# Altium project LAB2.PrjPcb
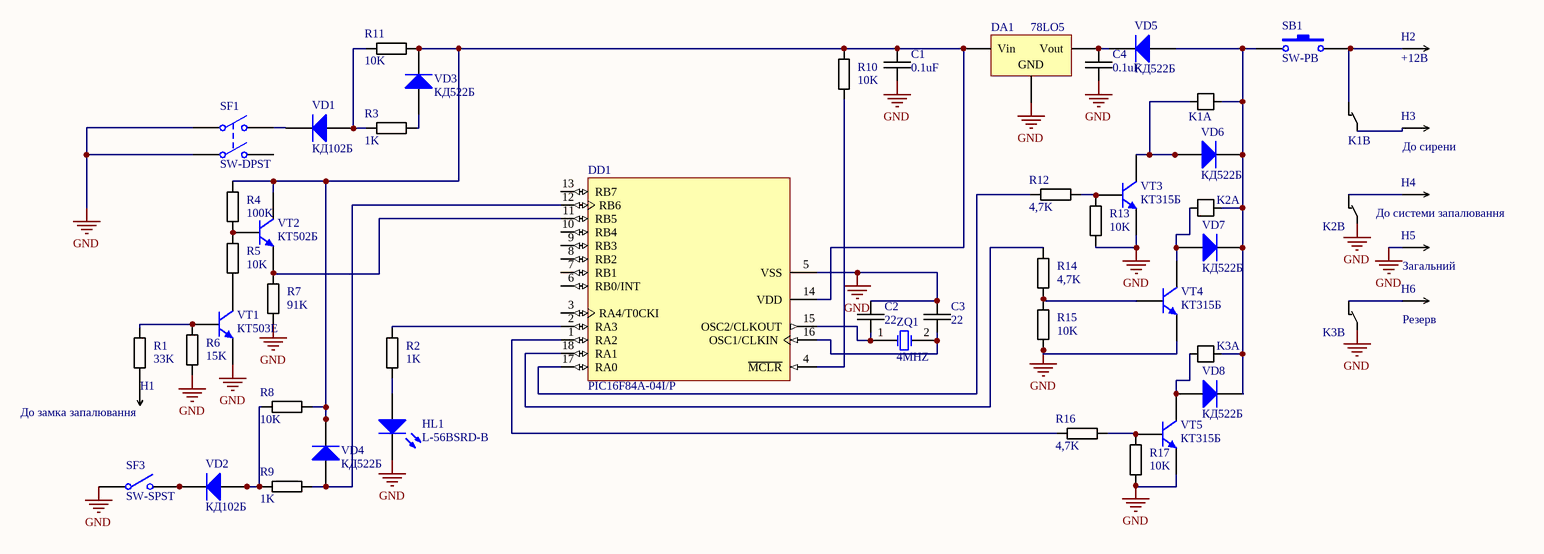
[diagram p0: LAB2.SchDoc]
1 sheet, 50 parts. Net scope: global (net labels, ports and power ports of the same name join across sheets).
Board file: LAB2.PcbDoc

## Sheet LAB2.SchDoc
size A4; SheetNumber: 1; SheetTotal: 1

### Parts
C1  0.1uF  [CAPACITOR 1206]
C2  22  [CAPACITOR 1206]
C3  22  [CAPACITOR 1206]
C4  0.1uF  [CAPACITOR 1206]
DA1  78LO5  [D2PAK_N]
DD1  PIC16F84A-04I/P  [PDIP300-P18]
H1  До замка запалювання  [Hole 2.5]
H2  +12В  [Hole 2.5]
H3  До сирени  [Hole 2.5]
H4  До системи запалювання  [Hole 2.5]
H5  Загальний  [Hole 2.5]
H6  Резерв  [Hole 2.5]
HL1  L-56BSRD-B  [LED-1]
K1  Relay SPST  [g2rl-1a-e]  (value not drawn)  (parts A,B of 2)
K2  Relay SPST  [g2rl-1a-e]  (value not drawn)  (parts A,B of 2)
K3  Relay SPST  [g2rl-1a-e]  (value not drawn)  (parts A,B of 2)
R1  33K  [Resistor 1206]
R2  1K  [Resistor 1206]
R3  1K  [Resistor 1206]
R4  100K  [Resistor 1206]
R5  10K  [Resistor 1206]
R6  15K  [Resistor 1206]
R7  91K  [Resistor 1206]
R8  10K  [Resistor 1206]
R9  1K  [Resistor 1206]
R10  10K  [Resistor 1206]
R11  10K  [Resistor 1206]
R12  4,7K  [Resistor 1206]
R13  10K  [Resistor 1206]
R14  4,7K  [Resistor 1206]
R15  10K  [Resistor 1206]
R16  4,7K  [Resistor 1206]
R17  10K  [Resistor 1206]
SB1  SW-PB  [SPST-2]
SF1  SW-DPST  [DPST-4]
SF3  SW-SPST  [SPST-2]
VD1  КД102Б  [DO-35]
VD2  КД102Б  [DO-35]
VD3  КД522Б  [DO-35]
VD4  КД522Б  [DO-35]
VD5  КД522Б  [DO-35]
VD6  КД522Б  [DO-35]
VD7  КД522Б  [DO-35]
VD8  КД522Б  [DO-35]
VT1  КТ503Е  [TO-92A]
VT2  КТ502Б  [TO-92A]
VT3  КТ315Б  [TO-92A]
VT4  КТ315Б  [TO-92A]
VT5  КТ315Б  [TO-92A]
ZQ1  4MHZ  [R38]

### Nets
GND: C1.2 C2.1 C3.1 C4.2 DA1.2(GND) DD1.5(VSS) H5.0 HL1.2(K) K2.2 K3.2 R6.2 R7.2 R13.2 R15.2 R17.2 SF1.1(COMMON1) SF1.3(COMMON2) SF3.1(COMMON) VT1.1(E) VT3.1(E) VT4.1(E) VT5.1(E)
NetC1_1: C1.1 DA1.1(Vin) DD1.14(VDD) R4.1 R8.1 R10.1 R11.2 VD3.2(K) VD4.2(K) VT2.3(C)
NetC2_2: C2.2 DD1.15(OSC2/CLKOUT) ZQ1.1(OSC1)
NetC3_2: C3.2 DD1.16(OSC1/CLKIN) ZQ1.2(OSC2)
NetC4_1: C4.1 DA1.3(Vout) VD5.2(K)
NetDD1_1: DD1.1(RA2) R16.1
NetDD1_2: DD1.2(RA3) R2.1
NetDD1_4: DD1.4(~{MCLR}) R10.2
NetDD1_11: DD1.11(RB5) R7.1 VT2.1(E)
NetDD1_12: DD1.12(RB6) R9.1 VD4.1(A)
NetDD1_17: DD1.17(RA0) R12.1
NetDD1_18: DD1.18(RA1) R14.1
NetH1_0: H1.0 R1.2
NetH2_0: H2.0 K1.3 SB1.2
NetH3_0: H3.0 K1.2
NetH4_0: H4.0 K2.3
NetH6_0: H6.0 K3.3
NetHL1_1: HL1.1(A) R2.2
NetK1_0: K1.0 VD6.1(A) VT3.3(C)
NetK1_1: K1.1 K2.1 K3.1 SB1.1 VD5.1(A) VD6.2(K) VD7.2(K) VD8.2(K)
NetK2_0: K2.0 VD7.1(A) VT4.3(C)
NetK3_0: K3.0 VD8.1(A) VT5.3(C)
NetR1_1: R1.1 R6.1 VT1.2(B)
NetR3_1: R3.1 R11.1 VD1.1(A)
NetR3_2: R3.2 VD3.1(A)
NetR4_2: R4.2 R5.1 VT2.2(B)
NetR5_2: R5.2 VT1.3(C)
NetR8_2: R8.2 R9.2 VD2.1(A)
NetR12_2: R12.2 R13.1 VT3.2(B)
NetR14_2: R14.2 R15.1 VT4.2(B)
NetR16_2: R16.2 R17.1 VT5.2(B)
NetSF1_2: SF1.2(NO1) VD1.2(K)
NetSF3_2: SF3.2(NO) VD2.2(K)

Not connected (* = marked no-connect by the designer): DD1 3(RA4/T0CKI) 6(RB0/INT) 7(RB1) 8(RB2) 9(RB3) 10(RB4) 13(RB7); SF1 4(NO2)

### Library data of the parts
C1-C4 = Capasitor: Value: *
DA1 = Volt Reg: Voltage Regulator; Published: 24-Mar-1999; LatestRevisionDate: 29-May-2009; LatestRevisionNote: IPC-7351 Footprint Added.; PackageReference: D2PAK; Publisher: Altium Limited; PackageDescription: 3-Pin Transistor Outline Package 2.54 mm Pitch, 15.1 mm Lead Span
DD1 = CMP-0115-00205-1: Enhanced FLASH/EEPROM 8-Bit Microcontroller, 1K (x14-Bit words) FLASH, 68 Bytes RAM, 4 MHz, 18-Pin PDIP, Standard VDD Range, Industrial Temperature; PackageReference: PDIP300-P18; Code_JEDEC: MS-001; DatasheetVersion: revB, Aug-2001; PackageDescription: 18-Lead Plastic Dual In-Line (P) - 300 mil Body [PDIP]; PackageVersion: revBB, Aug-2009
H1-H6 = Hole
HL1 = LED1: Typical RED GaAs LED; Published: 8-Jun-2000; LatestRevisionDate: 08-Jul-2005; LatestRevisionNote: Mech Layer 1 removed.; PackageReference: LED-1; Publisher: Altium Limited; PackageDescription: LED; 2 Leads
R1-R17 = Resistor: Value: *
SB1 = SW-PB: Switch; Published: 24-Mar-1999; LatestRevisionDate: 17-Jul-2002; LatestRevisionNote: Re-released for DXP Platform.; PackageReference: SPST-2; Publisher: Altium Limited; PackageDescription: Switch; 2 Leads
SF1 = SW-DPST: Double-Pole, Single-Throw Switch; Published: 24-Mar-1999; LatestRevisionDate: 17-Jul-2002; LatestRevisionNote: Re-released for DXP Platform.; PackageReference: DPST-4; Publisher: Altium Limited; PackageDescription: Switch; 4 Leads
SF3 = SW-SPST: Single-Pole, Single-Throw Switch; Published: 24-Mar-1999; LatestRevisionDate: 17-Jul-2002; LatestRevisionNote: Re-released for DXP Platform.; PackageReference: SPST-2; Publisher: Altium Limited; PackageDescription: Switch; 2 Leads
VD1-VD8 = Diode 1N4448: High Conductance Fast Diode; Published: 8-Jun-2000; LatestRevisionDate: 17-Jul-2002; LatestRevisionNote: Re-released for DXP Platform.; DatasheetVersion: 1997; PackageReference: DO-35; Publisher: Altium Limited; PackageDescription: Diode, Axial; Body 3.8 x 1.9 mm (LxDia. max), Lead Dia. 0.53 mm (max); Code_JEDEC: DO-204-AH; ComponentLink1Description: Manufacturer Link; ComponentLink1URL: http://www.fairchildsemi.com/; ComponentLink2Description: Datasheet; ComponentLink2URL: http://www.fairchildsemi.com/ds/1N%2F1N4448.pdf
VT1-VT5 = 2N3904: NPN General Purpose Amplifier; Published: 8-Jun-2000; LatestRevisionDate: 17-Jan-2003; LatestRevisionNote: PCB Footprint replaced; DatasheetVersion: 1997; PackageVersion: Sep-1998; PackageReference: TO-92A; Publisher: Altium Limited; PackageDescription: TO, Flat Index; 3 In-Line, Axial Leads; Body Dia. 4.5mm; Leads 0.51 x 0.48 mm (max); ComponentLink1Description: Manufacturer Link; ComponentLink1URL: http://www.fairchildsemi.com/; ComponentLink2Description: Datasheet; ComponentLink2URL: http://www.fairchildsemi.com/ds/2N%2F2N3904.pdf
ZQ1 = XTAL: Crystal Oscillator; Published: 8-Jun-2000; LatestRevisionDate: 17-Jul-2002; LatestRevisionNote: Re-released for DXP Platform.; PackageReference: R38; Publisher: Altium Limited; PackageDescription: Crystal, Thru-Hole; 2 Leads; Body 3.1 x 8.2 mm (Dia.xH)